# Altium schematic sheet atmega16a (1).SchDoc
size 381 x 241 mm; SheetNumber: 1; SheetTotal: 1
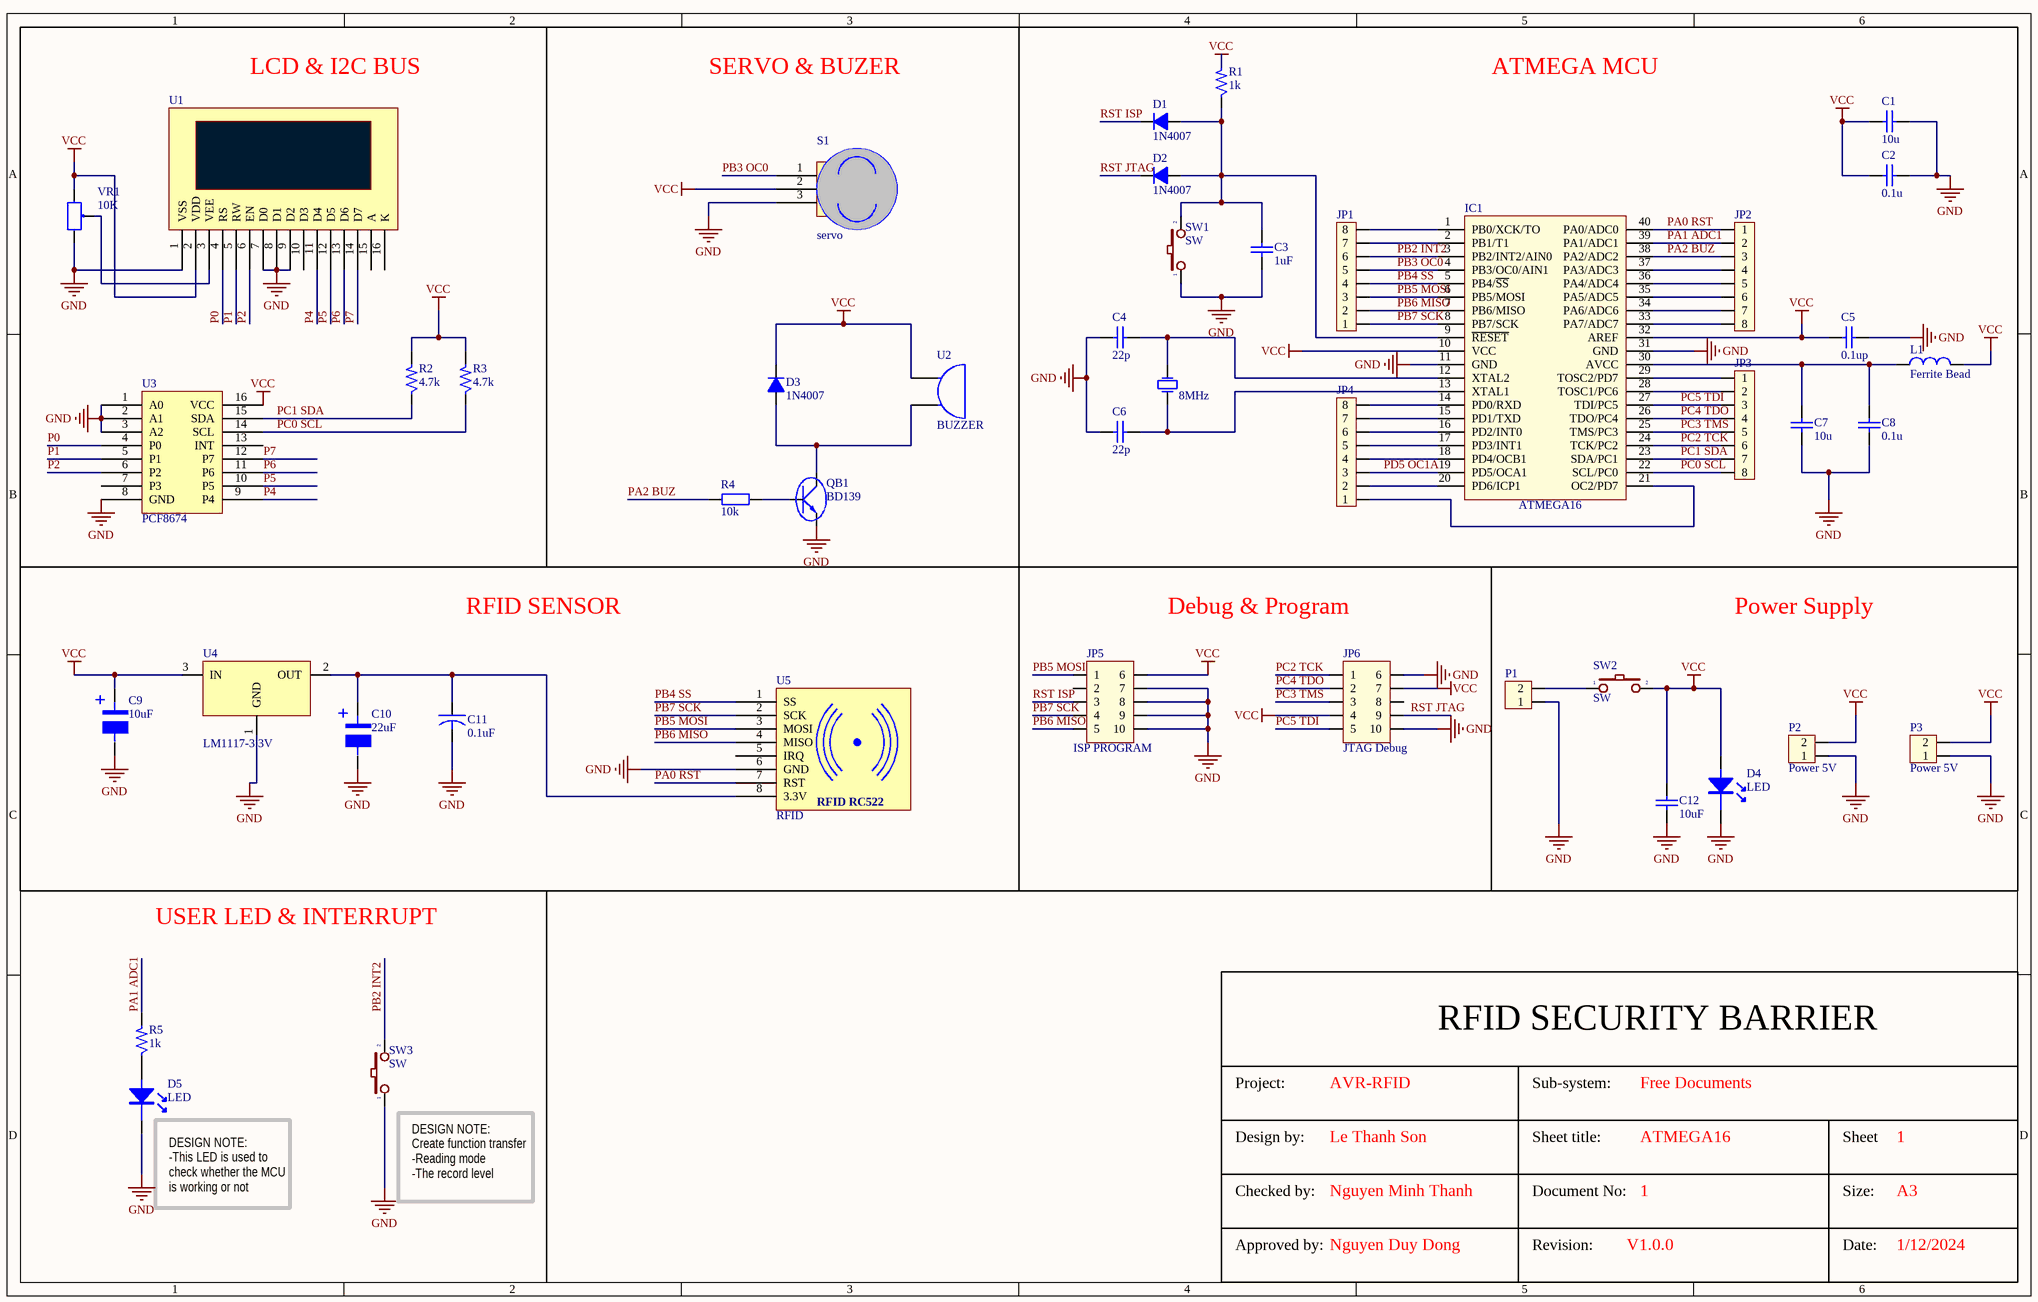
[diagram p0: atmega16a (1).SchDoc]

## Parts
C1  value 10u  [Tu-ceramic]  (hidden comment: Capacitor Ceramic)
C2  value 0.1u  [Tu-ceramic]  (hidden comment: Capacitor Ceramic)
C3  value 1uF  [C3MM]  (hidden comment: Cap)
C4  value 22p  [Tu-ceramic]  (hidden comment: Capacitor Ceramic)
C5  value 0.1up  [Tu-ceramic]  (hidden comment: Capacitor Ceramic)
C6  value 22p  [Tu-ceramic]  (hidden comment: Capacitor Ceramic)
C7  value 10u  [Tu-ceramic]  (hidden comment: Capacitor Ceramic)
C8  value 0.1u  [Tu-ceramic]  (hidden comment: Capacitor Ceramic)
C9  10uF  [Cap100uFx50V]
C10  22uF  [Cap100uFx50V]
C11  0.1uF  [RA75]
C12  value 10uF  [C3MM]  (hidden comment: Cap)
D1  1N4007  [D1A]
D2  1N4007  [D1A]
D3  1N4007  [D1A]
D4  LED  [CAP10UF]
D5  LED  [CAP10UF]
IC1  ATMEGA16  [DIP40/W0.6]
JP1  JP8 PIN  [JP8]  (value not drawn)
JP2  JP8 PIN  [JP8]  (value not drawn)
JP3  JP8 PIN  [JP8]  (value not drawn)
JP4  JP8 PIN  [JP8]  (value not drawn)
JP5  ISP PROGRAM  [JP5X2]
JP6  JTAG Debug  [JP5X2]
L1  Ferrite Bead  [L/0.4]
P1  (no value)  [CON2]
P2  Power 5V  [CON2]
P3  Power 5V  [CON2]
QB1  BD139  [QTO-247]
R1  1k  [R1/6W]
R2  4.7k  [R1/6W]
R3  4.7k  [R1/6W]
R4  10k  [R1/4W]
R5  1k  [R1/6W]
S1  servo  [PCBComponent_1]
SW1  SW  [SW2]
SW2  SW  [SW2]
SW3  SW  [SW2]
U1  LCD  [LCD16X2]  (value not drawn)
U2  BUZZER
U3  PCF8674  [DIP16]
U4  LM1117-3.3V  [SOT223-4N]
U5  RFID  [RFID RC522]
VR1  10K  [VR]
Y1  8MHz  [XT2]

## Nets
GND: C1.2 C2.2 C3.1 C4.1 C5.1 C6.1 C7.2 C8.2 C9.2 C10.2 C11.2 C12.1 D4.2 D5.2 IC1.11(GND) IC1.31(GND) JP5.7 JP5.8 JP5.9 JP5.10 JP6.6 JP6.10 P1.1 P2.1 P3.1 QB1.3(E) S1.3 SW1.1 SW3.1 U1.1(VSS) U1.7(D0) U1.8(D1) U1.9(D2) U3.1(A0) U3.2(A1) U3.3(A2) U3.8(GND) U4.1(GND) U5.6(GND) VR1.3
VCC: C1.1 C2.1 C5.2 C9.1 C12.2 D3.2(K) D4.1 IC1.10(VCC) IC1.32(AREF) JP5.6 JP6.4 JP6.7 L1.2 P2.2 P3.2 R1.2 R2.2 R3.2 S1.2 SW2.2 U1.2(VDD) U2.1(A) U3.16(VCC) U4.3(IN) VR1.1
P0: U1.4(RS) U3.4(P0)
P1: U1.5(RW) U3.5(P1)
P2: U1.6(EN) U3.6(P2)
P4: U1.11(D4) U3.9(P4)
P5: U1.12(D5) U3.10(P5)
P6: U1.13(D6) U3.11(P6)
P7: U1.14(D7) U3.12(P7)
PA0 RST: IC1.40(PA0/ADC0) JP2.1 U5.7(RST)
PA1 ADC1: IC1.39(PA1/ADC1) JP2.2 R5.2
PA2 BUZ: IC1.38(PA2/ADC2) JP2.3 R4.1
PB2 INT2: IC1.3(PB2/INT2/AIN0) JP1.6 SW3.2
PB3 OC0: IC1.4(PB3/OC0/AIN1) JP1.5 S1.1
PB4 SS: IC1.5(PB4/~{SS}) JP1.4 U5.1(SS)
PB5 MOSI: IC1.6(PB5/MOSI) JP1.3 JP5.1 U5.3(MOSI)
PB6 MISO: IC1.7(PB6/MISO) JP1.2 JP5.5 U5.4(MISO)
PB7 SCK: IC1.8(PB7/SCK) JP1.1 JP5.4 U5.2(SCK)
PC0 SCL: IC1.22(SCL/PC0) JP3.8 R3.1 U3.14(SCL)
PC1 SDA: IC1.23(SDA/PC1) JP3.7 R2.1 U3.15(SDA)
PC2 TCK: IC1.24(TCK/PC2) JP3.6 JP6.1
PC3 TMS: IC1.25(TMS/PC3) JP3.5 JP6.3
PC4 TDO: IC1.26(TDO/PC4) JP3.4 JP6.2
PC5 TDI: IC1.27(TDI/PC5) JP3.3 JP6.5
PD5 OC1A: IC1.19(PD5/OCA1) JP4.3
RST ISP: D1.2(K) JP5.3
RST JTAG: D2.2(K) JP6.9
NetC3_2: C3.2 D1.1(A) D2.1(A) IC1.9(~{RESET}) R1.1 SW1.2
NetC4_2: C4.2 IC1.12(XTAL2) Y1.2(OSC2)
NetC6_2: C6.2 IC1.13(XTAL1) Y1.1(OSC1)
NetC7_1: C7.1 C8.1 IC1.30(AVCC) L1.1
NetC10_1: C10.1 C11.1 U4.2(OUT) U5.8(3.3V)
NetD3_1: D3.1(A) QB1.2(C) U2.2(B)
NetD5_1: D5.1 R5.1
NetIC1_1: IC1.1(PB0/XCK/TO) JP1.8
NetIC1_2: IC1.2(PB1/T1) JP1.7
NetIC1_14: IC1.14(PD0/RXD) JP4.8
NetIC1_15: IC1.15(PD1/TXD) JP4.7
NetIC1_16: IC1.16(PD2/INT0) JP4.6
NetIC1_17: IC1.17(PD3/INT1) JP4.5
NetIC1_18: IC1.18(PD4/OCB1) JP4.4
NetIC1_20: IC1.20(PD6/ICP1) JP4.2
NetIC1_21: IC1.21(OC2/PD7) JP4.1
NetIC1_28: IC1.28(TOSC1/PC6) JP3.2
NetIC1_29: IC1.29(TOSC2/PD7) JP3.1
NetIC1_33: IC1.33(PA7/ADC7) JP2.8
NetIC1_34: IC1.34(PA6/ADC6) JP2.7
NetIC1_35: IC1.35(PA5/ADC5) JP2.6
NetIC1_36: IC1.36(PA4/ADC4) JP2.5
NetIC1_37: IC1.37(PA3/ADC3) JP2.4
NetP1_2: P1.2 SW2.1
NetQB1_1: QB1.1(B) R4.2
NetU1_3: U1.3(VEE) VR1.2

Not connected (* = marked no-connect by the designer): JP5 2; JP6 8; U1 10(D3) 15(A) 16(K); U3 7(P3) 13(INT); U5 5(IRQ)

## Notes on the sheet
- LCD & I2C BUS
- SERVO & BUZER
- ATMEGA MCU
- RFID SENSOR
- Debug & Program
- Power Supply
- USER LED & INTERRUPT
- (near D5) DESIGN NOTE:
  -This LED is used to check whether the MCU is working or not
- (near SW3) DESIGN NOTE:
  Create function transfer
  -Reading mode
  -The record level
- RFID SECURITY BARRIER
- Project:
- AVR-RFID
- Sub-system:
- Free Documents
- Design by:
- Le Thanh Son
- Sheet title:
- ATMEGA16
- Sheet
- 1
- Checked by:
- Approved by:
- Nguyen Minh Thanh
- Nguyen Duy Dong
- Document No:
- Revision:
- V1.0.0
- Size:
- Date:
- A3
- 1/12/2024
- (in symbol Cap100uF 50V) +
- (in symbol Component_1) RFID RC522

## Library data of the parts
C1 C2 C4-C8 = CapDecop: Capacitor; Published: 8-Jun-2000; LatestRevisionDate: 17-Jul-2002; LatestRevisionNote: Re-released for DXP Platform.; PackageReference: RAD-0.3; Publisher: Altium Limited
C3 C12 = Cap_1: Capacitor; Published: 8-Jun-2000; LatestRevisionDate: 17-Jul-2002; LatestRevisionNote: Re-released for DXP Platform.; PackageReference: RAD-0.3; Publisher: Altium Limited
C9 C10 = Cap100uF 50V: 220uF: 220uF
C11 = CAPACITOR
D1-D3 = D1A: Diode 1A; Value: 1N4007
IC1 = Atmega16L: 8-Bit AVR Microcontroller with 16K Bytes of In-System Programmable Flash Memory; Value: Atmega 16L
JP1-JP4 = JP8: Value: JP7
JP5 JP6 = JP5x2: Connector 5x2; Value: Connector 5x2
L1 = L1: Inductor; Value: 150 mH
P1-P3 = CON2: Connector 2; Value: Connector 2
QB1 = D718: Transistor Power Supply; Value: D718
R1-R3 R5 = Res: Resistor 1/4W; Value: R1/4W - 1K
R4 = R1/4W: Resistor 1/4W; Value: R1/4W - 1K
SW1-SW3 = SW2: Switch button 2 pin; Value: SW chip 2 pin
U1 = LCD: Value: LCD16x2
U3 U5 = Component_1
U4 = LM1117: 800mA Low-Dropout Linear Regulator; Creator: Nguyen Ba Bien; Website: http://group3i.net
VR1 = Var Resitor: Var Resistor; Value: VR 10K
Y1 = Crystal: Crystal Oscillator; Published: 8-Jun-2000; LatestRevisionDate: 17-Jul-2002; LatestRevisionNote: Re-released for DXP Platform.; PackageReference: R38; Publisher: Altium Limited